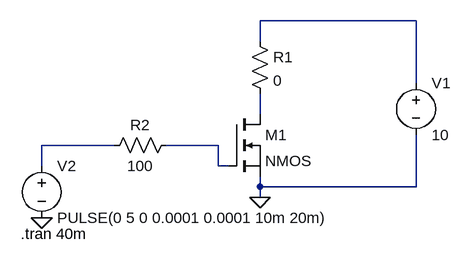
[diagram p0: schematic interruptor.asc]
interruptor.asc, the LTspice schematic file:
Version 4
SHEET 1 880 680
WIRE 448 16 208 16
WIRE 208 48 208 16
WIRE 448 112 448 16
WIRE 208 160 208 128
WIRE -16 208 -128 208
WIRE 144 208 64 208
WIRE -128 240 -128 208
WIRE 144 240 144 208
WIRE 160 240 144 240
WIRE 208 272 208 256
WIRE 448 272 448 192
WIRE 448 272 208 272
WIRE 208 288 208 272
FLAG 208 288 0
FLAG -128 320 0
SYMBOL res 192 32 R0
SYMATTR InstName R1
SYMATTR Value 0
SYMBOL voltage 448 96 R0
SYMATTR InstName V1
SYMATTR Value 10
SYMBOL voltage -128 224 R0
WINDOW 123 0 0 Left 2
WINDOW 39 0 0 Left 2
SYMATTR InstName V2
SYMATTR Value PULSE(0 5 0 0.0001 0.0001 10m 20m)
SYMBOL res 80 192 R90
WINDOW 0 0 56 VBottom 2
WINDOW 3 32 56 VTop 2
SYMATTR InstName R2
SYMATTR Value 100
SYMBOL nmos 160 160 R0
SYMATTR InstName M1
TEXT -160 344 Left 2 !.tran 40m

The netlist it stands for:
* interruptor.asc
R1 N001 N002 0
V1 N001 0 10
V2 N003 0 PULSE(0 5 0 0.0001 0.0001 10m 20m)
R2 N004 N003 100
M1 N002 N004 0 0 NMOS
.model NMOS NMOS
.model PMOS PMOS
.lib standard.mos
.tran 40m
.backanno
.end